# Altium schematic sheet breakout.schdoc: MCU Breakout
size 431 x 279 mm; DrawnBy: D. Bruey, M. Ciuffo; Organization: Synapse Product Development, LLC.; Address1: 1511 6th Ave., Suite 400; Address2: Seattle, Washington 98101; Address3: 206.381.0898; Address4: www.synapse.com; DocumentNumber: 15; SheetNumber: 4; SheetTotal: 7; PageSetup: Record=PageOptions|CenterHorizontal=True|CenterVertical=True|PrintScale=1.06|XCorrection=1.00|YCorrection=1.00|PrintKind=1|BorderSize=5000000|LeftOffset=0|BottomOffset=0|Orientation=2|PaperLength=4318|PaperWidth=2794|Scale=100|PaperSource=7|PrintQuality=200|MediaType=1|DitherType=10|PrintScaleMode=1|PaperKind=11x17|PaperIndex=3
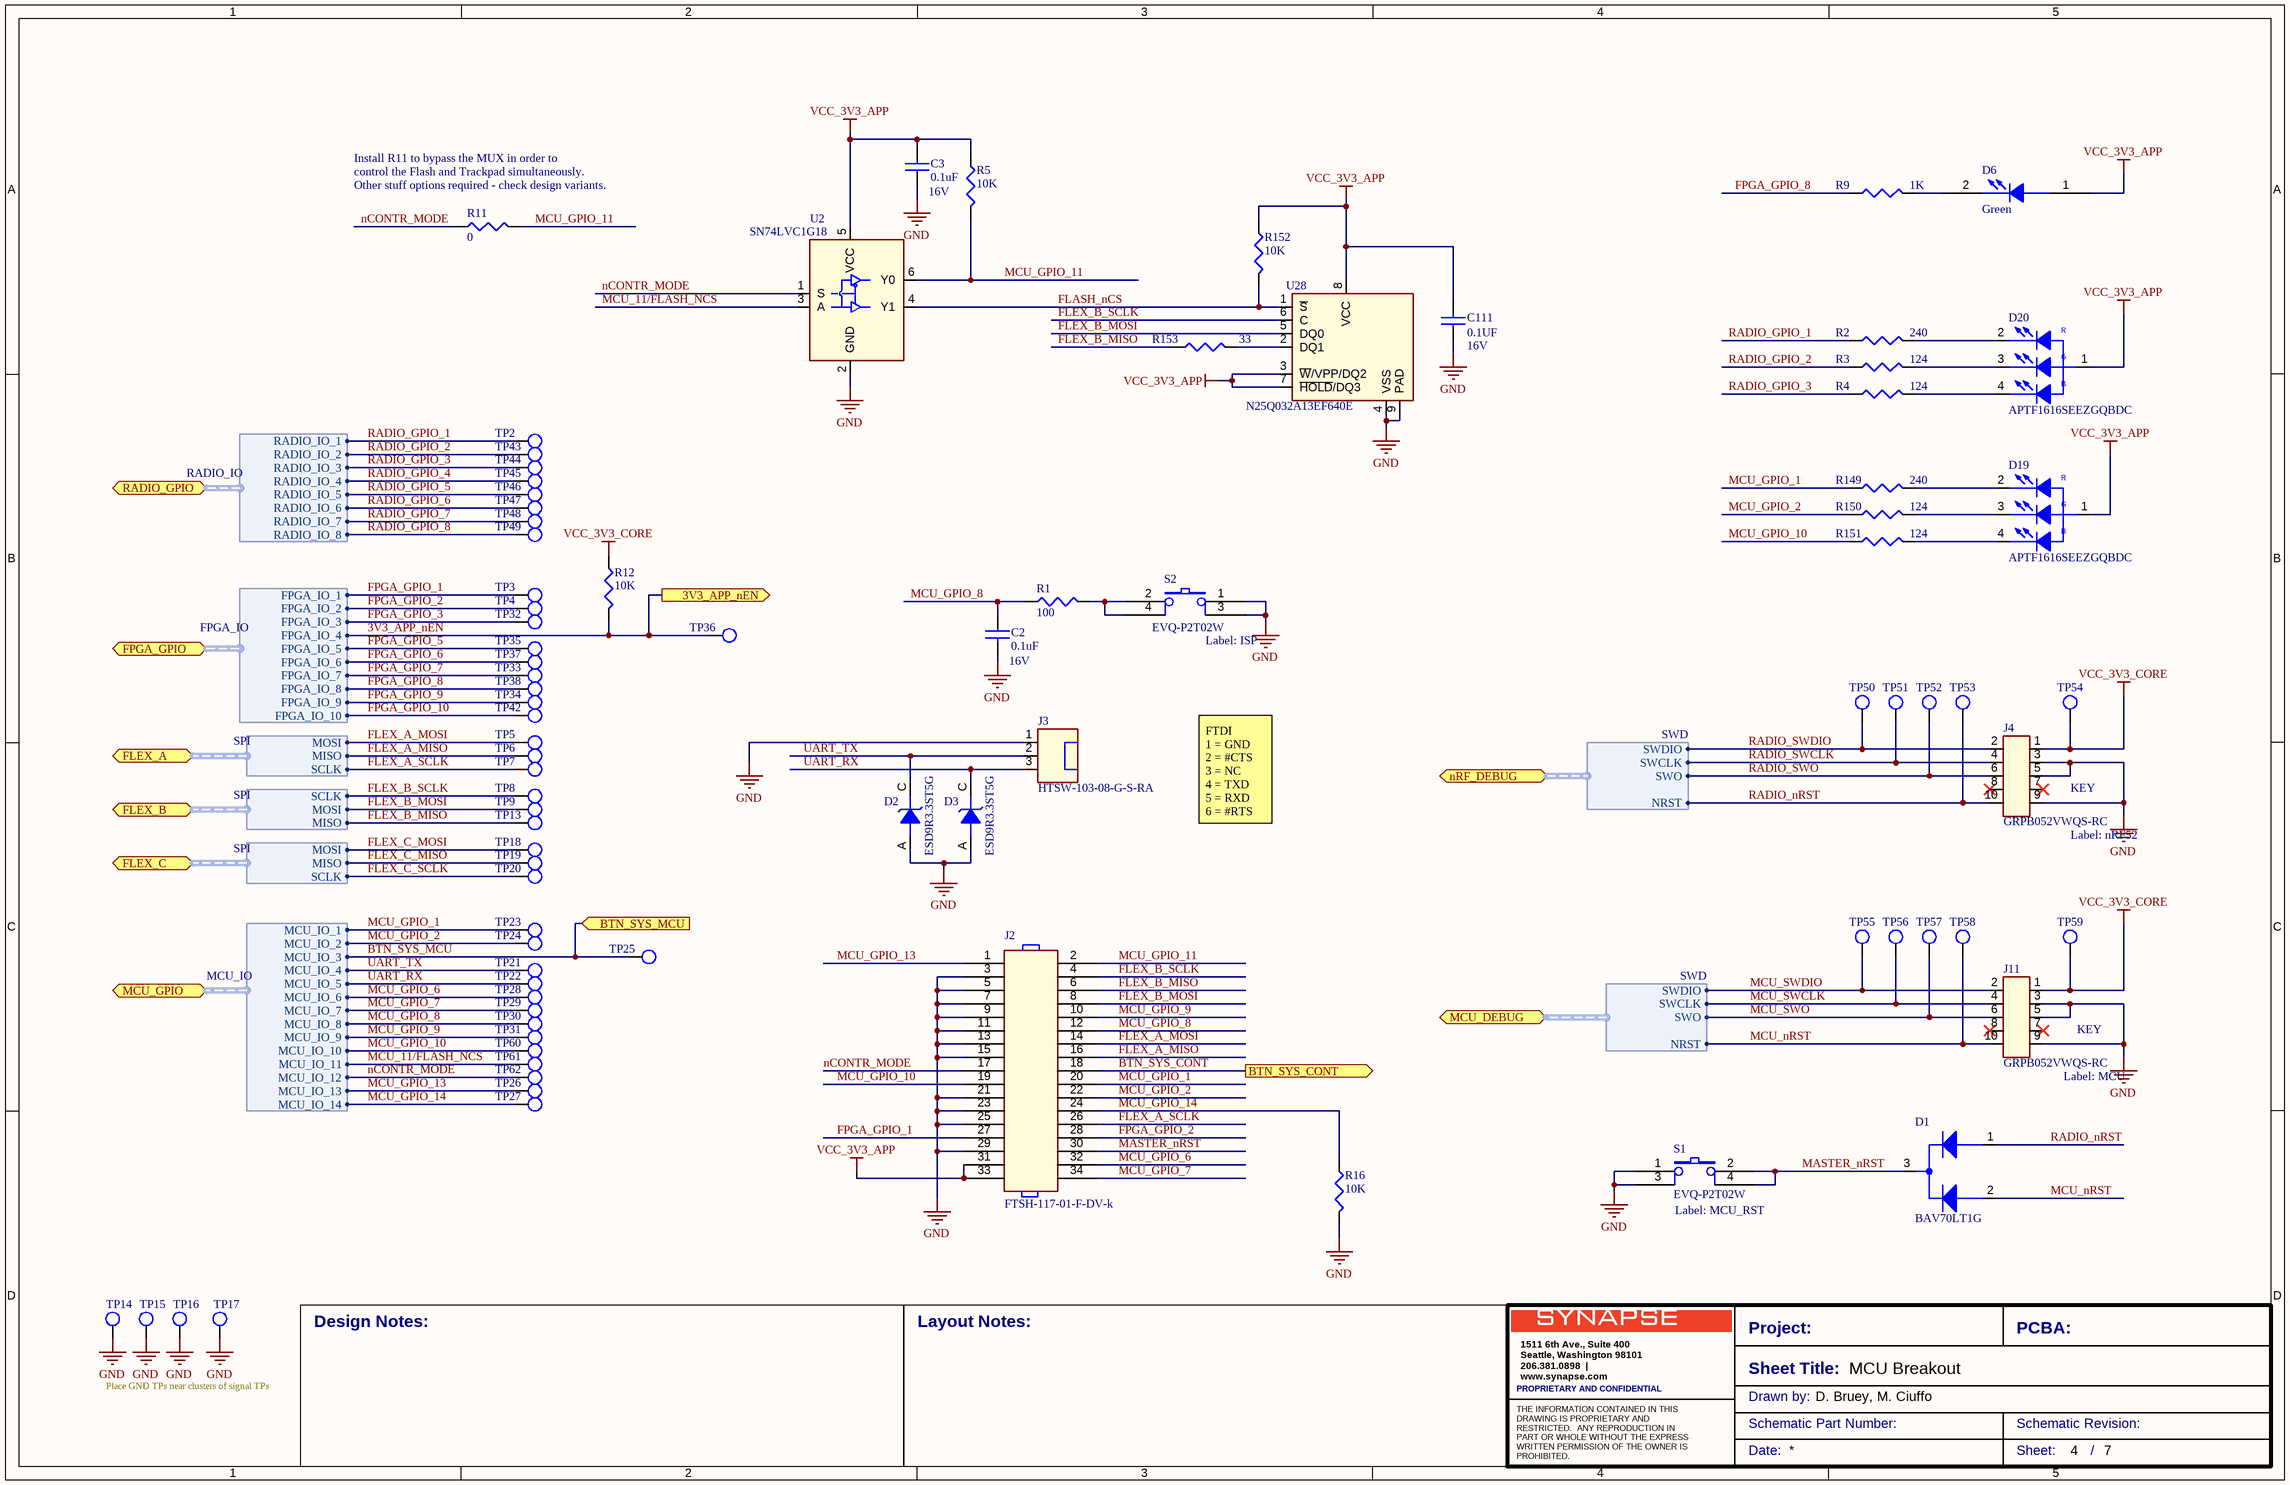
[diagram p0: breakout.schdoc]

## Parts
C2  0.1uF  Voltage: 16V  [0402-IPCsm_55]
C3  0.1uF  Voltage: 16V  [0402-IPCsm_55]
C111  0.1UF  Voltage: 16V  [0603-ipcsm_90]
D1  BAV70LT1G  [SOT23_44H]
D2  ESD9R3.3ST5G  [sod923-40]
D3  ESD9R3.3ST5G  [sod923-40]
D6  Green  [led_ltst-c191kgkt_s80]
D19  APTF1616SEEZGQBDC  [led_RBG_1p6x1p6_sm]
D20  APTF1616SEEZGQBDC  [led_RBG_1p6x1p6_sm]
J2  FTSH-117-01-F-DV-k  [FTSH-117-01-XXX-DV-K]
J3  HTSW-103-08-G-S-RA  [CON_HDR_1X3_RA]
J4  GRPB052VWQS-RC  [con_hdr_2x5_smt_50l]
J11  GRPB052VWQS-RC  [con_hdr_2x5_smt_50l]
R1  100  [0402-IPCsm_40]
R2  240  [0402-IPCsm_40]
R3  124  [0402-IPCsm_40]
R4  124  [0402-IPCsm_40]
R5  10K  [0402-IPCsm_40]
R9  1K  [0603-IPCsm_56]
R11  0  [0402-IPCsm_40]
R12  10K  [0402-IPCsm_40]
R16  10K  [0402-IPCsm_40]
R149  240  [0402-IPCsm_40]
R150  124  [0402-IPCsm_40]
R151  124  [0402-IPCsm_40]
R152  10K  [0402-IPCsm_40]
R153  33  [0402-IPCsm_40]
S1  EVQ-P2T02W  [SW_EVQP2]
S2  EVQ-P2T02W  [SW_EVQP2]
TP2  tp-1mm  [TP-S100_SMT]  (value not drawn)  (no BOM)
TP3  tp-1mm  [TP-S100_SMT]  (value not drawn)  (no BOM)
TP4  tp-1mm  [TP-S100_SMT]  (value not drawn)  (no BOM)
TP5  tp-1mm  [TP-S100_SMT]  (value not drawn)  (no BOM)
TP6  tp-1mm  [TP-S100_SMT]  (value not drawn)  (no BOM)
TP7  tp-1mm  [TP-S100_SMT]  (value not drawn)  (no BOM)
TP8  tp-1mm  [TP-S100_SMT]  (value not drawn)  (no BOM)
TP9  tp-1mm  [TP-S100_SMT]  (value not drawn)  (no BOM)
TP13  tp-1mm  [TP-S100_SMT]  (value not drawn)  (no BOM)
TP14  tp-1mm  [TP-S100_SMT]  (value not drawn)  (no BOM)
TP15  tp-1mm  [TP-S100_SMT]  (value not drawn)  (no BOM)
TP16  tp-1mm  [TP-S100_SMT]  (value not drawn)  (no BOM)
TP17  tp-1mm  [TP-S100_SMT]  (value not drawn)  (no BOM)
TP18  tp-1mm  [TP-S100_SMT]  (value not drawn)  (no BOM)
TP19  tp-1mm  [TP-S100_SMT]  (value not drawn)  (no BOM)
TP20  tp-1mm  [TP-S100_SMT]  (value not drawn)  (no BOM)
TP21  tp-1mm  [TP-S100_SMT]  (value not drawn)  (no BOM)
TP22  tp-1mm  [TP-S100_SMT]  (value not drawn)  (no BOM)
TP23  tp-1mm  [TP-S100_SMT]  (value not drawn)  (no BOM)
TP24  tp-1mm  [TP-S100_SMT]  (value not drawn)  (no BOM)
TP25  tp-1mm  [TP-S100_SMT]  (value not drawn)  (no BOM)
TP26  tp-1mm  [TP-S100_SMT]  (value not drawn)  (no BOM)
TP27  tp-1mm  [TP-S100_SMT]  (value not drawn)  (no BOM)
TP28  tp-1mm  [TP-S100_SMT]  (value not drawn)  (no BOM)
TP29  tp-1mm  [TP-S100_SMT]  (value not drawn)  (no BOM)
TP30  tp-1mm  [TP-S100_SMT]  (value not drawn)  (no BOM)
TP31  tp-1mm  [TP-S100_SMT]  (value not drawn)  (no BOM)
TP32  tp-1mm  [TP-S100_SMT]  (value not drawn)  (no BOM)
TP33  tp-1mm  [TP-S100_SMT]  (value not drawn)  (no BOM)
TP34  tp-1mm  [TP-S100_SMT]  (value not drawn)  (no BOM)
TP35  tp-1mm  [TP-S100_SMT]  (value not drawn)  (no BOM)
TP36  tp-1mm  [TP-S100_SMT]  (value not drawn)  (no BOM)
TP37  tp-1mm  [TP-S100_SMT]  (value not drawn)  (no BOM)
TP38  tp-1mm  [TP-S100_SMT]  (value not drawn)  (no BOM)
TP42  tp-1mm  [TP-S100_SMT]  (value not drawn)  (no BOM)
TP43  tp-1mm  [TP-S100_SMT]  (value not drawn)  (no BOM)
TP44  tp-1mm  [TP-S100_SMT]  (value not drawn)  (no BOM)
TP45  tp-1mm  [TP-S100_SMT]  (value not drawn)  (no BOM)
TP46  tp-1mm  [TP-S100_SMT]  (value not drawn)  (no BOM)
TP47  tp-1mm  [TP-S100_SMT]  (value not drawn)  (no BOM)
TP48  tp-1mm  [TP-S100_SMT]  (value not drawn)  (no BOM)
TP49  tp-1mm  [TP-S100_SMT]  (value not drawn)  (no BOM)
TP50  tp-1mm  [TP-S100_SMT]  (value not drawn)  (no BOM)
TP51  tp-1mm  [TP-S100_SMT]  (value not drawn)  (no BOM)
TP52  tp-1mm  [TP-S100_SMT]  (value not drawn)  (no BOM)
TP53  tp-1mm  [TP-S100_SMT]  (value not drawn)  (no BOM)
TP54  tp-1mm  [TP-S100_SMT]  (value not drawn)  (no BOM)
TP55  tp-1mm  [TP-S100_SMT]  (value not drawn)  (no BOM)
TP56  tp-1mm  [TP-S100_SMT]  (value not drawn)  (no BOM)
TP57  tp-1mm  [TP-S100_SMT]  (value not drawn)  (no BOM)
TP58  tp-1mm  [TP-S100_SMT]  (value not drawn)  (no BOM)
TP59  tp-1mm  [TP-S100_SMT]  (value not drawn)  (no BOM)
TP60  tp-1mm  [TP-S100_SMT]  (value not drawn)  (no BOM)
TP61  tp-1mm  [TP-S100_SMT]  (value not drawn)  (no BOM)
TP62  tp-1mm  [TP-S100_SMT]  (value not drawn)  (no BOM)
U2  SN74LVC1G18  [SON6_TI_DRY]
U28  N25Q032A13EF640E  [MLP8_N25Q032A_F6]

## Ports
3V3_APP_nEN (out), BTN_SYS_CONT (out), BTN_SYS_MCU (in), FLEX_A (harness SPI), FLEX_B (harness SPI), FLEX_C (harness SPI), FPGA_GPIO (harness FPGA_IO), MCU_DEBUG (harness SWD), MCU_GPIO (harness MCU_IO), nRF_DEBUG (harness SWD), RADIO_GPIO (harness RADIO_IO)

## Harnesses
SWD: NRST, SWCLK, SWDIO, SWO
MCU_IO: MCU_IO_2, MCU_IO_3, MCU_IO_4, MCU_IO_5, MCU_IO_6, MCU_IO_7, MCU_IO_8, MCU_IO_9, MCU_IO_10, MCU_IO_1, MCU_IO_11, MCU_IO_12, MCU_IO_13, MCU_IO_14
SPI: MOSI, MISO, SCLK
SWD: SWCLK, SWDIO, SWO, NRST
RADIO_IO: RADIO_IO_1, RADIO_IO_2, RADIO_IO_3, RADIO_IO_4, RADIO_IO_5, RADIO_IO_6, RADIO_IO_7, RADIO_IO_8
FPGA_IO: FPGA_IO_2, FPGA_IO_3, FPGA_IO_4, FPGA_IO_5, FPGA_IO_6, FPGA_IO_7, FPGA_IO_8, FPGA_IO_9, FPGA_IO_10, FPGA_IO_1

## Nets
GND: C2.2 C3.1 C111.1 D2.A D3.A J2.3 J2.5 J2.7 J2.9 J2.11 J2.13 J2.15 J2.21 J2.23 J2.25 J2.29 J3.1 J4.3 J4.5 J4.9 J11.3 J11.5 J11.9 R16.2 S1.1 S1.3 S2.1 S2.3 TP14.1(TP) TP15.1(TP) TP16.1(TP) TP17.1(TP) U2.2(GND) U28.4(VSS) U28.9(PAD)
VCC_3V3_APP: C3.2 C111.2 D6.1(A) D19.1(ANODE) D20.1(ANODE) J2.31 J2.33 R5.1 R152.1 U2.5(VCC) U28.3(~{W}/VPP/DQ2) U28.7(~{HOLD}/DQ3) U28.8(VCC)
VCC_3V3_CORE: J4.1 J11.1 R12.1 TP54.1(TP) TP59.1(TP)
3V3_APP_nEN: R12.2 TP36.1(TP) ; port 3V3_APP_nEN, port FPGA_GPIO.FPGA_IO_4
BTN_SYS_CONT: J2.18 ; port BTN_SYS_CONT
BTN_SYS_MCU: TP25.1(TP) ; port BTN_SYS_MCU, port MCU_GPIO.MCU_IO_3
FLASH_nCS: R152.2 U2.4(Y1) U28.1(~{S})
FLEX_A_MISO: J2.16 TP6.1(TP) ; port FLEX_A.MISO
FLEX_A_MOSI: J2.14 TP5.1(TP) ; port FLEX_A.MOSI
FLEX_A_SCLK: J2.26 TP7.1(TP) ; port FLEX_A.SCLK
FLEX_B_MISO: J2.6 R153.1 TP13.1(TP) ; port FLEX_B.MISO
FLEX_B_MOSI: J2.8 TP9.1(TP) U28.5(DQ0) ; port FLEX_B.MOSI
FLEX_B_SCLK: J2.4 TP8.1(TP) U28.6(C) ; port FLEX_B.SCLK
FLEX_C_MISO: TP19.1(TP) ; port FLEX_C.MISO
FLEX_C_MOSI: TP18.1(TP) ; port FLEX_C.MOSI
FLEX_C_SCLK: TP20.1(TP) ; port FLEX_C.SCLK
FPGA_GPIO_1: J2.27 TP3.1(TP) ; port FPGA_GPIO.FPGA_IO_1
FPGA_GPIO_2: J2.28 TP4.1(TP) ; port FPGA_GPIO.FPGA_IO_2
FPGA_GPIO_3: TP32.1(TP) ; port FPGA_GPIO.FPGA_IO_3
FPGA_GPIO_5: TP35.1(TP) ; port FPGA_GPIO.FPGA_IO_5
FPGA_GPIO_6: TP37.1(TP) ; port FPGA_GPIO.FPGA_IO_6
FPGA_GPIO_7: TP33.1(TP) ; port FPGA_GPIO.FPGA_IO_7
FPGA_GPIO_8: R9.2 TP38.1(TP) ; port FPGA_GPIO.FPGA_IO_8
FPGA_GPIO_9: TP34.1(TP) ; port FPGA_GPIO.FPGA_IO_9
FPGA_GPIO_10: TP42.1(TP) ; port FPGA_GPIO.FPGA_IO_10
MASTER_nRST: D1.3(A) J2.30 S1.2 S1.4
MCU_11/FLASH_NCS: TP61.1(TP) U2.3(A) ; port MCU_GPIO.MCU_IO_11
MCU_GPIO_1: J2.20 R149.1 TP23.1(TP) ; port MCU_GPIO.MCU_IO_1
MCU_GPIO_2: J2.22 R150.1 TP24.1(TP) ; port MCU_GPIO.MCU_IO_2
MCU_GPIO_6: J2.32 TP28.1(TP) ; port MCU_GPIO.MCU_IO_6
MCU_GPIO_7: J2.34 TP29.1(TP) ; port MCU_GPIO.MCU_IO_7
MCU_GPIO_8: C2.1 J2.12 R1.1 TP30.1(TP) ; port MCU_GPIO.MCU_IO_8
MCU_GPIO_9: J2.10 TP31.1(TP) ; port MCU_GPIO.MCU_IO_9
MCU_GPIO_10: J2.19 R151.1 TP60.1(TP) ; port MCU_GPIO.MCU_IO_10
MCU_GPIO_11: J2.2 R5.2 R11.2 U2.6(Y0)
MCU_GPIO_13: J2.1 TP26.1(TP) ; port MCU_GPIO.MCU_IO_13
MCU_GPIO_14: J2.24 R16.1 TP27.1(TP) ; port MCU_GPIO.MCU_IO_14
MCU_nRST: D1.2(C2) J11.10 TP58.1(TP) ; port MCU_DEBUG.NRST
MCU_SWCLK: J11.4 TP56.1(TP) ; port MCU_DEBUG.SWCLK
MCU_SWDIO: J11.2 TP55.1(TP) ; port MCU_DEBUG.SWDIO
MCU_SWO: J11.6 TP57.1(TP) ; port MCU_DEBUG.SWO
nCONTR_MODE: J2.17 R11.1 TP62.1(TP) U2.1(S) ; port MCU_GPIO.MCU_IO_12
RADIO_GPIO_1: R2.1 TP2.1(TP) ; port RADIO_GPIO.RADIO_IO_1
RADIO_GPIO_2: R3.1 TP43.1(TP) ; port RADIO_GPIO.RADIO_IO_2
RADIO_GPIO_3: R4.1 TP44.1(TP) ; port RADIO_GPIO.RADIO_IO_3
RADIO_GPIO_4: TP45.1(TP) ; port RADIO_GPIO.RADIO_IO_4
RADIO_GPIO_5: TP46.1(TP) ; port RADIO_GPIO.RADIO_IO_5
RADIO_GPIO_6: TP47.1(TP) ; port RADIO_GPIO.RADIO_IO_6
RADIO_GPIO_7: TP48.1(TP) ; port RADIO_GPIO.RADIO_IO_7
RADIO_GPIO_8: TP49.1(TP) ; port RADIO_GPIO.RADIO_IO_8
RADIO_nRST: D1.1(C1) J4.10 TP53.1(TP) ; port nRF_DEBUG.NRST
RADIO_SWCLK: J4.4 TP51.1(TP) ; port nRF_DEBUG.SWCLK
RADIO_SWDIO: J4.2 TP50.1(TP) ; port nRF_DEBUG.SWDIO
RADIO_SWO: J4.6 TP52.1(TP) ; port nRF_DEBUG.SWO
UART_RX: D3.C J3.3 TP22.1(TP) ; port MCU_GPIO.MCU_IO_5
UART_TX: D2.C J3.2 TP21.1(TP) ; port MCU_GPIO.MCU_IO_4
NetD6_2: D6.2(C) R9.1
NetD19_2: D19.2(R) R149.2
NetD19_3: D19.3(G) R150.2
NetD19_4: D19.4(B) R151.2
NetD20_2: D20.2(R) R2.2
NetD20_3: D20.3(G) R3.2
NetD20_4: D20.4(B) R4.2
NetR1_2: R1.2 S2.2 S2.4
NetR153_2: R153.2 U28.2(DQ1)

Not connected (* = marked no-connect by the designer): J4 7* 8*; J11 7* 8*

## Notes on the sheet
- Install R11 to bypass the MUX in order to
- (near R11) control the Flash and Trackpad simultaneously.
- (near R11) Other stuff options required - check design variants.
- (near S2) Label: ISP
- FTDI
  1 = GND
  2 = #CTS
  3 = NC
  4 = TXD
  5 = RXD
  6 = #RTS
- (near J4) KEY
- (near J4) Label: nRF52
- (near J11) KEY
- (near J11) Label: MCU
- (near S1) Label: MCU_RST
- Place GND TPs near clusters of signal TPs
- Design Notes:
- Layout Notes:
- Project:
- Sheet Title:
- PCBA:
- PROPRIETARY AND CONFIDENTIAL
- Drawn by:
- Schematic Part Number:
- Schematic Revision:
- Date:
- Sheet:
- /

## Library data of the parts
C2 C3 = GRM155R71C104KA88D: CAP CER .1UF 16V X7R 0402; part_type: capacitor; id: 588; mfg: MURATA; dist: DIGIKEY; dist_pn: 490-3261-1-ND; source_package: C_0P1U_16V_X7R_0402; tolerance: 10%; TableName: viewAltiumCapacitors; mfg_pn: GRM155R71C104KA88D; type: X7R; height: 0.55MM; status: Unknown
C111 = C0603C104J4RACTU: CAP CER 0.1UF 16V 5% X7R 0603; part_type: capacitor; id: 1053; mfg: Kemet; dist: Digi-Key; dist_pn: 399-1097-1-ND; source_package: C_0U1_16V_X7R_0603; TableName: viewAltiumCapacitors; mfg_pn: C0603C104J4RACTU; type: X7R; height: 0.87MM; status: Unknown; tolerance: 5%
D1 = BAV70LT1G: DIODE SWITCH DUAL CC 70V SOT23; id: 594; mfg: ON Semi; dist: Digikey; dist_pn: BAV70LT1GOSCT-ND; type: Standard; tolerance: na; power: 225mW; current: 200mA; TableName: viewAltiumDiscretes; mfg_pn: BAV70LT1G; part_type: diode; source_package: DIODE 2 CC; voltage: 70V; height: 1.1MM; status: Unknown
D2 D3 = ESD9R3.3ST5G: TVS DIODE 3.3VWM 7.8VC SOD923; id: 1102; mfg: On Semiconductor; dist: Digikey; dist_pn: ESD9R3.3ST5GOSCT-ND; voltage: 3.3V; TableName: viewAltiumDiscretes; mfg_pn: ESD9R3.3ST5G; part_type: tvs; type: TVS; status: Unknown; height: 0.4mm
D6 = LTST-C191KGKT: LED GREEN CLEAR THIN 0603 SMD; part_type: Discretes; id: 1137; mfg: Lite-On Inc; dist: Digikey; dist_pn: 160-1446-1-ND; voltage: 3.2V; current: 20mA; TableName: viewAltiumDiscretes; layout_notes: symbol now has A/C pins instead of 1/2, check footprint accordingly.; mfg_pn: LTST-C191KGKT; source_package: LTST-C191KGKT; status: Good; height: 0.55mm; type: LED
D19 D20 = APTF1616SEEZGQBDC: LED RGB CLEAR 0606 SMD; id: 1228; mfg: Kingbright; dist: Digikey; dist_pn: 754-1500-2-ND; current: 25mA; TableName: viewAltiumDiscretes; mfg_pn: APTF1616SEEZGQBDC; part_type: LED; source_package: LED; height: .7mm; status: Unknown
J2 = FTSH-117-01-F-DV-k: 34 Positions Header, Shrouded Connector 0.050" (1.27mm) Surface Mount Gold; id: 1653; mfg: Samtec; dist: Digikey; dist_pn: SAM8912-ND; positions: 34; TableName: viewAltiumConnectors; mfg_pn: FTSH-117-01-F-DV-K; part_type: connector; height: 5.97mm; status: Unknown
J3 = HTSW-103-08-G-S-RA: 3 Positions Header, Unshrouded Connector 0.100" (2.54mm) Through Hole, Right Angle Gold; id: 1657; mfg: Samtec; dist: DIGIKEY; dist_pn: SAM8924-ND; positions: 3; TableName: viewAltiumConnectors; mfg_pn: HTSW-103-08-G-S-RA; part_type: connector; height: 3.02mm; status: Unknown
J4 J11 = GRPB052VWQS-RC: CONN HEADER .050" 10PS DL SMD AU; part_type: Connector; id: 1425; mfg: Sullins Connector Solutions; dist: Digikey; dist_pn: S9012E-05-ND; TableName: viewAltiumConnectors; mfg_pn: GRPB052VWQS-RC; source_package: GRPB052VWQS-RC; type: Header; status: Good
R1 = MCR01MZPJ101: RES 100 OHM 5% 0402 SMD; part_type: resistor; Tolerance: 5.00%; DIST: DIGIKEY; MFG: ROHM; DIST_PN: RHM100JCT-ND; id: 1182; source_package: R_ 100_5P_0402; TableName: viewAltiumResistors; Height: 0.4MM; MFG_PN: MCR01MZPJ101; status: Unknown
R2 R149 = ERJ-2RKF2400X: RES 240 OHM 1/10W 1% 0402 SMD; part_type: resistor; DIST: Digikey; MFG: Panasonic; DIST_PN: P240LDKR-ND; Power: 0.1W; id: 2285; TableName: viewAltiumResistors; Tolerance: 1%; Height: 0.4mm; MFG_PN: ERJ-2RKF2400X; status: Good
R3 R4 R150 R151 = RC0402FR-07124RL: RES SMD 124 OHM 1% 1/16W 0402; part_type: resistor; Tolerance: 1.00%; DIST: DIGIKEY; MFG: Yageo; DIST_PN: 311-124LRCT-ND; Power: 0.0625W; id: 2370; TableName: viewAltiumResistors; Height: .4mm; MFG_PN: RC0402FR-07124RL; status: Unknown
R5 R12 R16 R152 = ERJ-2GEJ103X: RES 10K OHM 1/10W 5% 0402 SMD; part_type: resistor; DIST: Digikey; MFG: Panasonic; DIST_PN: P10KJCT-ND; id: 2252; source_package: R_10K_5P_0402; TableName: viewAltiumResistors; Tolerance: 5%; Height: 0.4mm; MFG_PN: ERJ-2GEJ103X; status: Unknown
R9 = RC0603FR-071KL: RES 1K 1/10W 1% 0603 SMD; part_type: resistor; Tolerance: 1.00%; Voltage: 50V; DIST: Digikey; MFG: Yageo; DIST_PN: 311-1.00KHRTR-ND; Power: 0.1W; id: 1277; source_package: R_1K_0.1P_0603; TableName: viewAltiumResistors; Type: "; Height: 0.5MM; MFG_PN: RC0603FR-071KL; status: Unknown
R11 = ERJ-2GE0R00X: RES 0.0 OHM 1/10W JUMP 0402 SMD; part_type: resistor; Tolerance: 5.00%; DIST: DIGIKEY; MFG: PANASONIC; DIST_PN: P0.0JDKR-ND; Power: 0.063W; id: 1129; source_package: R_0_5P_0402; TableName: viewAltiumResistors; Height: 0.4MM; MFG_PN: ERJ-2GE0R00X; status: Unknown
R153 = ERJ-2GEJ330X: RES 33 OHM 1/16W 5% 0402 SMD; part_type: resistor; Tolerance: 5.00%; Voltage: 50V; DIST: DIGIKEY; MFG: PANASONIC; DIST_PN: P33JCT-ND; Power: 0.063W; id: 1154; source_package: R_33_0402_5P; TableName: viewAltiumResistors; Height: .4MM; MFG_PN: ERJ-2GEJ330X; status: Unknown
S1 S2 = EVQ-P2T02W: SWITCH TACTILE SPST-NO 0.02A 15V; part_type: Misc; id: 1187; mfg: Panasonic; dist: Digikey; dist_pn: P11083SCT-ND; voltage: 15VDC; TableName: viewAltiumMisc; mfg_pn: EVQ-P2T02W; source_package: EVQ-P2T02W; height: 2.7mm; status: Unknown
TP2-TP9 TP13-TP38 TP42-TP62 = TP0042: TESTPOINT, 1MM SMD, Square pad, Round SM opening; part_type: test_point; mfg_pn: TP0042; mfg: NA; id: 888; TableName: viewAltiumMisc; dist: NA; dist_pn: NA; source_package: tp_smt; status: Unknown
U2 = SN74LVC1G18DRYR: IC SGL OPEN DRAIN BUFFER SC70-5; Manufacturer: TI; id: 2517; dist: DIGIKEY; dist_pn: 296-30526-1-ND; source_package: IC 1OF2 NON-INV DEMUX 3ST 6SON; TableName: viewAltiumIcs; mfg_pn: SN74LVC1G18DRYR; mfg: TI; part_type: ic; status: Good
U28 = N25Q032A13EF640E: IC FLASH 32MBIT 108MHZ 8VDFN; id: 2417; mfg: Micron; TableName: viewAltiumIcs; mfg_pn: N25Q032A13EF640E; dist: Micron; dist_pn: N25Q032A13EF640E; part_type: ic; source_package: N25Q032A13EF640E; status: Unknown; datasheet: http://www.micron.com/~/media/Documents/Products/Data%20Sheet/NOR%20Flash/Serial%20NOR/N25Q/n25q_32mb_3v_65nm.pdf